# EAGLE design SAM E70-XplainedShield - DualStepperMotorDriver (EAGLE 9.1.3)
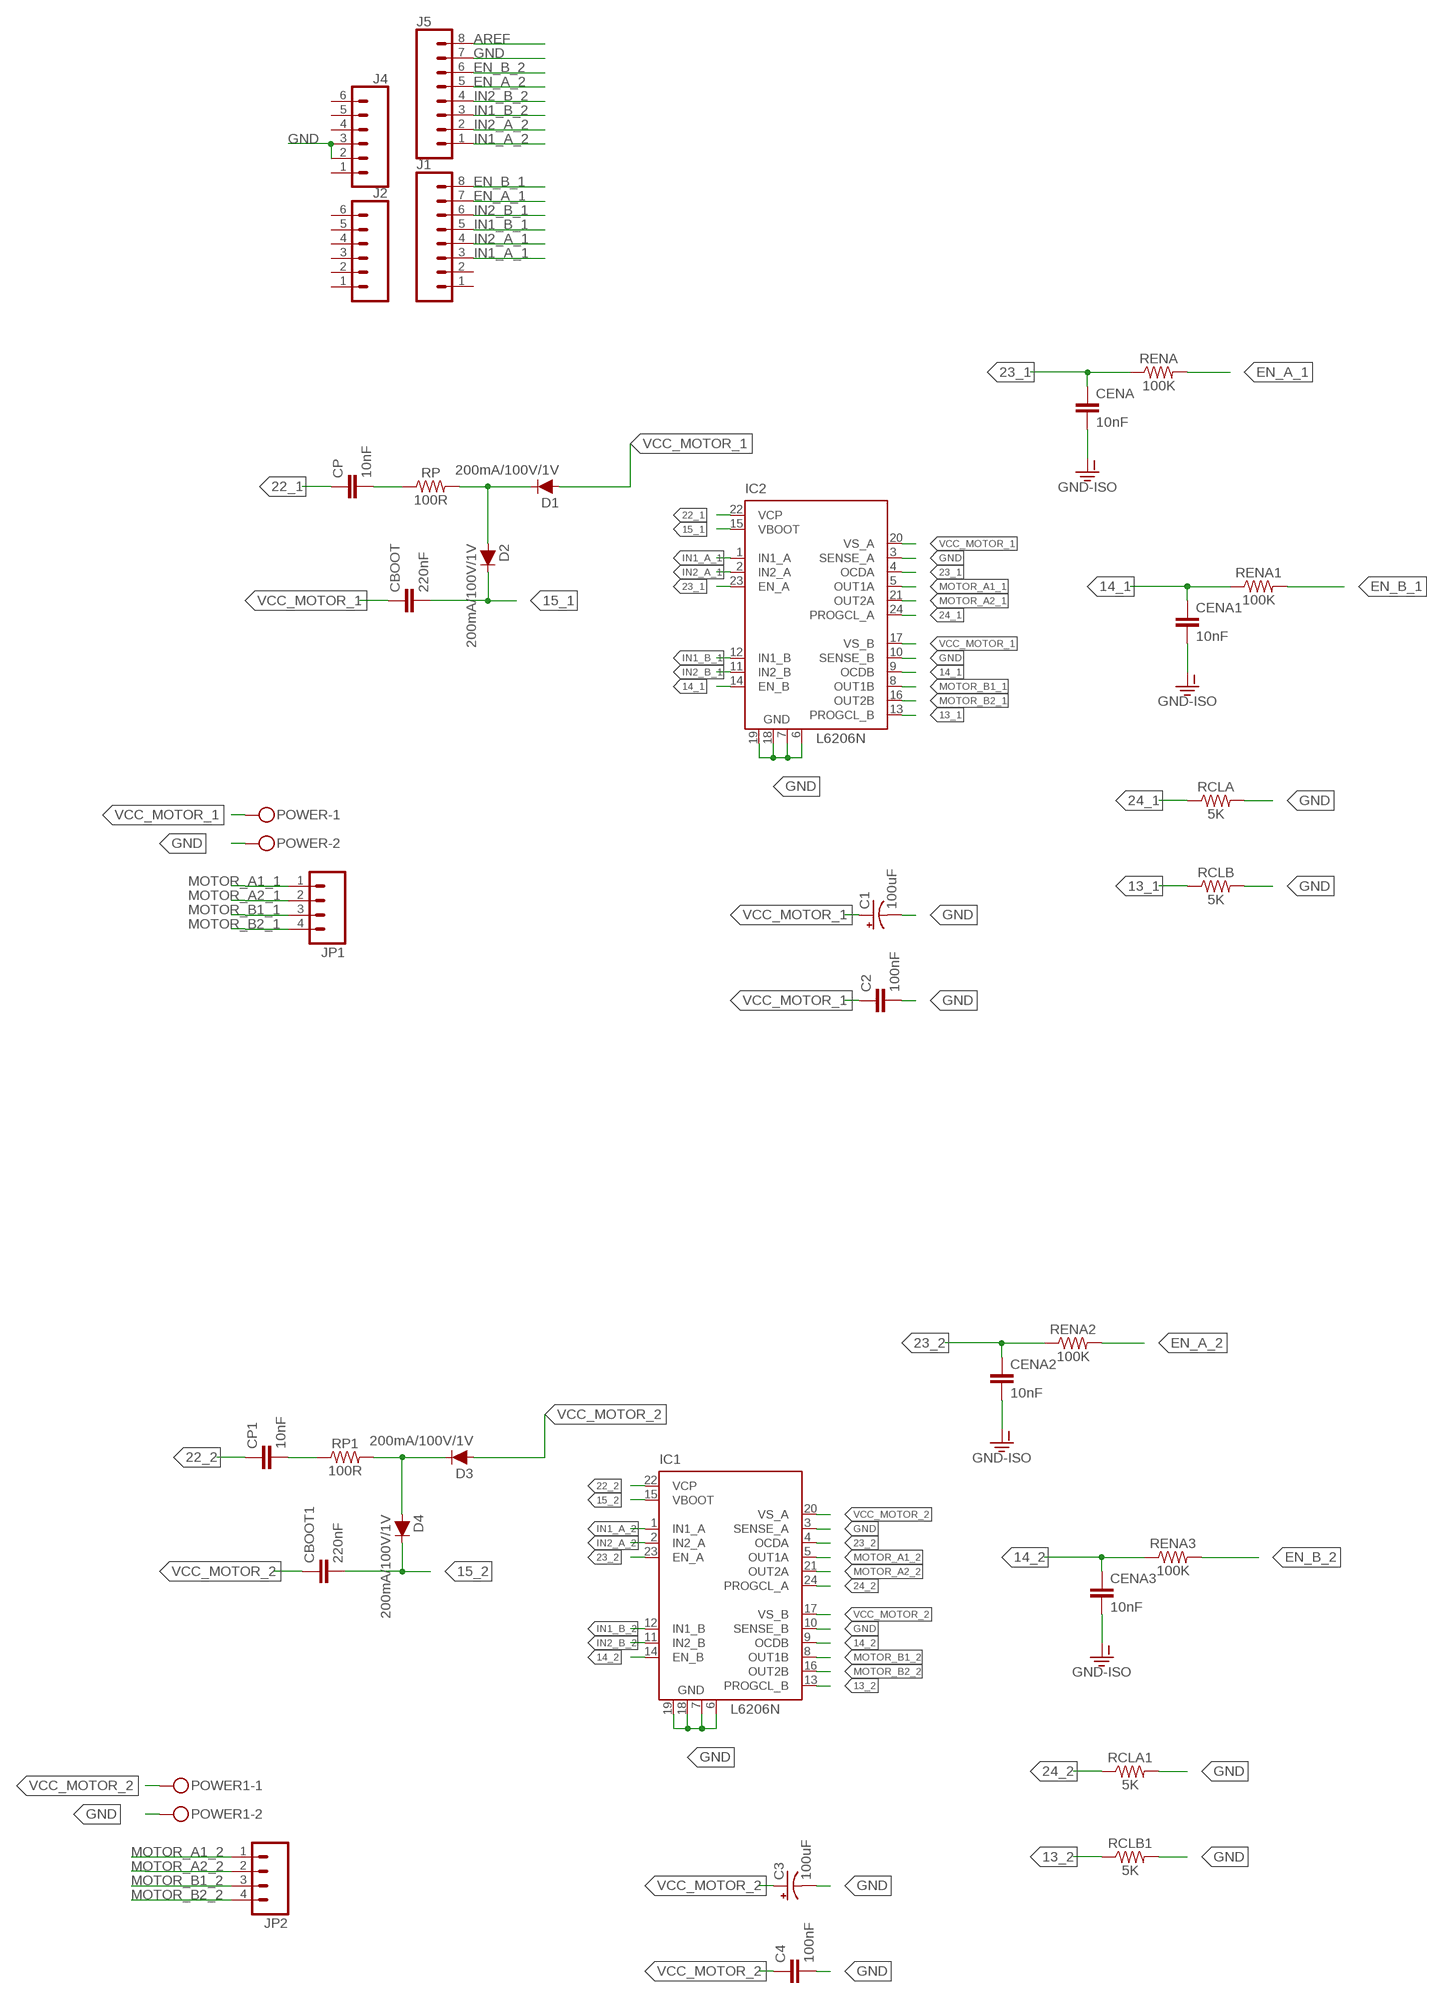
[diagram p0: schematic, sheet 1]

## Parts
C1  100uF  CAP_POLPTH1  [CPOL-RADIAL-100UF-25V]
C2  100nF  CAPKIT  [CAP-PTH-SMALL-KIT]
C3  100uF  CAP_POLPTH1  [CPOL-RADIAL-100UF-25V]
C4  100nF  CAPKIT  [CAP-PTH-SMALL-KIT]
CBOOT  220nF  CAPKIT  [CAP-PTH-SMALL-KIT]
CBOOT1  220nF  CAPKIT  [CAP-PTH-SMALL-KIT]
CENA  10nF  CAPKIT  [CAP-PTH-SMALL-KIT]
CENA1  10nF  CAPKIT  [CAP-PTH-SMALL-KIT]
CENA2  10nF  CAPKIT  [CAP-PTH-SMALL-KIT]
CENA3  10nF  CAPKIT  [CAP-PTH-SMALL-KIT]
CP  10nF  CAPKIT  [CAP-PTH-SMALL-KIT]
CP1  10nF  CAPKIT  [CAP-PTH-SMALL-KIT]
D1  200mA/100V/1V  DIODE-1N4148  [DIODE-1N4148]
D2  200mA/100V/1V  DIODE-1N4148  [DIODE-1N4148]
D3  200mA/100V/1V  DIODE-1N4148  [DIODE-1N4148]
D4  200mA/100V/1V  DIODE-1N4148  [DIODE-1N4148]
IC1  L6206N  [DIL24S]
IC2  L6206N  [DIL24S]
J1  CONN_08LONGPADS  [1X08_LONGPADS]
J2  CONN_06LONGPADS  [1X06_LONGPADS]
J4  CONN_06LONGPADS  [1X06_LONGPADS]
J5  CONN_08LONGPADS  [1X08_LONGPADS]
JP1  M04LONGPADS  [1X04_LONGPADS]
JP2  M04LONGPADS  [1X04_LONGPADS]
POWER  MKDSN1,5/2-5,08  [MKDSN1,5/2-5,08]
POWER1  MKDSN1,5/2-5,08  [MKDSN1,5/2-5,08]
RCLA  5K  RESISTORAXIAL-0.3-KIT  [AXIAL-0.3-KIT]
RCLA1  5K  RESISTORAXIAL-0.3-KIT  [AXIAL-0.3-KIT]
RCLB  5K  RESISTORAXIAL-0.3-KIT  [AXIAL-0.3-KIT]
RCLB1  5K  RESISTORAXIAL-0.3-KIT  [AXIAL-0.3-KIT]
RENA  100K  RESISTORAXIAL-0.3-KIT  [AXIAL-0.3-KIT]
RENA1  100K  RESISTORAXIAL-0.3-KIT  [AXIAL-0.3-KIT]
RENA2  100K  RESISTORAXIAL-0.3-KIT  [AXIAL-0.3-KIT]
RENA3  100K  RESISTORAXIAL-0.3-KIT  [AXIAL-0.3-KIT]
RP  100R  RESISTORAXIAL-0.3-KIT  [AXIAL-0.3-KIT]
RP1  100R  RESISTORAXIAL-0.3-KIT  [AXIAL-0.3-KIT]

## Nets
13_1: IC2.13(PROGCL_B) RCLB.P$1
13_2: IC1.13(PROGCL_B) RCLB1.P$1
14_1: CENA1.1 IC2.9(OCDB) IC2.14(EN_B) RENA1.P$1
14_2: CENA3.1 IC1.9(OCDB) IC1.14(EN_B) RENA3.P$1
15_1: CBOOT.2 D2.C IC2.15(VBOOT)
15_2: CBOOT1.2 D4.C IC1.15(VBOOT)
22_1: CP.1 IC2.22(VCP)
22_2: CP1.1 IC1.22(VCP)
23_1: CENA.1 IC2.4(OCDA) IC2.23(EN_A) RENA.P$1
23_2: CENA2.1 IC1.4(OCDA) IC1.23(EN_A) RENA2.P$1
24_1: IC2.24(PROGCL_A) RCLA.P$1
24_2: IC1.24(PROGCL_A) RCLA1.P$1
AREF: J5.8
EN_A_1: J1.7 RENA.P$2
EN_A_2: J5.5 RENA2.P$2
EN_B_1: J1.8 RENA1.P$2
EN_B_2: J5.6 RENA3.P$2
GND: C1.2(-) C2.2 C3.2(-) C4.2 CENA1.2 CENA2.2 CENA3.2 CENA.2 IC1.3(SENSE_A) IC1.6(GND) IC1.7(GND) IC1.10(SENSE_B) IC1.18(GND) IC1.19(GND) IC2.3(SENSE_A) IC2.6(GND) IC2.7(GND) IC2.10(SENSE_B) IC2.18(GND) IC2.19(GND) J4.2 J4.3 J5.7 POWER1.2 POWER.2 RCLA1.P$2 RCLA.P$2 RCLB1.P$2 RCLB.P$2 ; supply symbol labelled GND-ISO
IN1_A_1: IC2.1(IN1_A) J1.3
IN1_A_2: IC1.1(IN1_A) J5.1
IN1_B_1: IC2.12(IN1_B) J1.5
IN1_B_2: IC1.12(IN1_B) J5.3
IN2_A_1: IC2.2(IN2_A) J1.4
IN2_A_2: IC1.2(IN2_A) J5.2
IN2_B_1: IC2.11(IN2_B) J1.6
IN2_B_2: IC1.11(IN2_B) J5.4
MOTOR_A1_1: IC2.5(OUT1A) JP1.1
MOTOR_A1_2: IC1.5(OUT1A) JP2.1
MOTOR_A2_1: IC2.21(OUT2A) JP1.2
MOTOR_A2_2: IC1.21(OUT2A) JP2.2
MOTOR_B1_1: IC2.8(OUT1B) JP1.3
MOTOR_B1_2: IC1.8(OUT1B) JP2.3
MOTOR_B2_1: IC2.16(OUT2B) JP1.4
MOTOR_B2_2: IC1.16(OUT2B) JP2.4
N$1: CP1.2 RP1.P$1
N$2: CP.2 RP.P$1
N$3: D1.C D2.A RP.P$2
N$4: D3.C D4.A RP1.P$2
VCC_MOTOR_1: C1.1(+) C2.1 CBOOT.1 D1.A IC2.17(VS_B) IC2.20(VS_A) POWER.1
VCC_MOTOR_2: C3.1(+) C4.1 CBOOT1.1 D3.A IC1.17(VS_B) IC1.20(VS_A) POWER1.1
Unconnected: J1.1 J1.2 J2.1 J2.2 J2.3 J2.4 J2.5 J2.6 J4.1 J4.4 J4.5 J4.6

## Library data of the parts
C1 C3 = SparkFun-Capacitors:CAP_POL: Capacitor Polarized These are standard SMD and PTH capacitors. Normally 10uF, 47uF, and 100uF in electrolytic and tantalum varieties. Always verify the external diameter of the through hole cap, it varies with capacity, voltage, and manufacturer. The EIA devices should be standard.
C2 C4 CBOOT CBOOT1 CENA CENA1-CENA3 CP CP1 = SparkFun-Capacitors:CAP: Capacitor Standard 0603 ceramic capacitor, and 0.1" leaded capacitor.
D1-D4 = SparkFun-DiscreteSemi:DIODE: Diode These are standard reverse protection diodes and small signal diodes. SparkFun Products: SparkFun SparkPunk Sound Kit <https://www.sparkfun.com/products/11177> SparkFun ESP8266 Thing <https://www.sparkfun.com/products/13231>; PROD_ID: DIO-08378
IC1 IC2 = L6206:L6206: DMOS dual full bridge driver
J1 J5 = SparkFun-Connectors:CONN_08: Multi connection point. Often used as Generic Header-pin footprint for 0.1 inch spaced/style header connections On any of the 0.1 inch spaced packages, you can populate with these: Break Away Headers - Straight <https://www.sparkfun.com/products/116> (PRT-00116) Break Away Male Headers - Right Angle <https://www.sparkfun.com/products/553> (PRT-00553) Female Headers <https://www.sparkfun.com/products/115> (PRT-00115) Break Away Headers - Machine Pin <https://www.sparkfun.com/products/117> (PRT-00117) Break Away Female Headers - Swiss Machine Pin <https://www.sparkfun.com/products/743> (PRT-00743) Arduino Stackable Header - 8 Pin <https://www.sparkfun.com/products/9279> (PRT-09279) For SCREWTERMINALS and SPRING TERMINALS visit here: Screw Terimnals on SparkFun.com <https://www.sparkfun.com/search/results?term=Screw+Terminals> (5mm/3.5mm/2.54mm spacing) This device is also useful as a general connection point to wire up your design to another part of your project. Our various solder wires solder well into these plated through hole pads. Hook-Up Wire - Assortment (Stranded, 22 AWG) <https://www.sparkfun.com/products/11375> (PRT-11375) Hook-Up Wire - Assortment (Solid Core, 22 AWG) <https://www.sparkfun.com/products/11367> (PRT-11367) View the entire wire category on our website here <https://www.sparkfun.com/categories/141> Special notes: Molex polarized connector foot print use with SKU : PRT-08231 with associated crimp pins and housings. 1MM SMD Version SKU: PRT-10208 NOTES ON THE VARIANTS LOCK and LOCK_LONGPADS... This footprint was designed to help hold the alignment of a through-hole component (i.e. 6-pin header) while soldering it into place. You may notice that each hole has been shifted either up or down by 0.005 of an inch from it's more standard position (which is a perfectly straight line). This slight alteration caused the pins (the squares in the middle) to touch the edges of the holes. Because they are alternating, it causes a "brace" to hold the component in place. 0.005 has proven to be the perfect amount of "off-center" position when using our standard breakaway headers. Although looks a little odd when you look at the bare footprint, once you have a header in there, the alteration is very hard to notice. Also,if you push a header all the way into place, it is covered up entirely on the bottom side.
J2 J4 = SparkFun-Connectors:CONN_06: Multi connection point. Often used as Generic Header-pin footprint for 0.1 inch spaced/style header connections On any of the 0.1 inch spaced packages, you can populate with these: Break Away Headers - Straight <https://www.sparkfun.com/products/116> (PRT-00116) Break Away Male Headers - Right Angle <https://www.sparkfun.com/products/553> (PRT-00553) Female Headers <https://www.sparkfun.com/products/115> (PRT-00115) Break Away Headers - Machine Pin <https://www.sparkfun.com/products/117> (PRT-00117) Break Away Female Headers - Swiss Machine Pin <https://www.sparkfun.com/products/743> (PRT-00743) Arduino Stackable Header - 6 Pin <https://www.sparkfun.com/products/9280> (PRT-09280) For SCREWTERMINALS and SPRING TERMINALS visit here: Screw Terimnals on SparkFun.com <https://www.sparkfun.com/search/results?term=Screw+Terminals> (5mm/3.5mm/2.54mm spacing) This device is also useful as a general connection point to wire up your design to another part of your project. Our various solder wires solder well into these plated through hole pads. Hook-Up Wire - Assortment (Stranded, 22 AWG) <https://www.sparkfun.com/products/11375> (PRT-11375) Hook-Up Wire - Assortment (Solid Core, 22 AWG) <https://www.sparkfun.com/products/11367> (PRT-11367) View the entire wire category on our website here <https://www.sparkfun.com/categories/141>
JP1 JP2 = SparkFun-Connectors:M04: Header 4 Standard 4-pin 0.1" header. Use with straight break away headers (SKU : PRT-00116), right angle break away headers (PRT-00553), swiss pins (PRT-00743), machine pins (PRT-00117), and female headers (PRT-00115). Molex polarized connector foot print use with SKU : PRT-08231 with associated crimp pins and housings. 1MM SMD Version SKU: PRT-10208
POWER POWER1 = con-phoenix-508:MKDSN1,5/2-5,08: MKDSN 1,5/ 2-5,08 Printklemme Nennstrom: 13,5 A Nennspannung: 250 V Rastermaß: 5,08 mm Polzahl: 2 Anschlussart: Schraubanschluss Montage: Löten Anschlussrichtung Leiter/Platine: 0 ° Artikelnummer: 1729128 Source: http://eshop.phoenixcontact.com .. 1729128.pdf
RCLA RCLA1 RCLB RCLB1 RENA RENA1-RENA3 RP RP1 = SparkFun-Resistors:RESISTOR: Generic Resistor Package

## Net classes
0 default: width 0.7 mm, drill 0.9 mm, clearance 0.205 mm

## Board
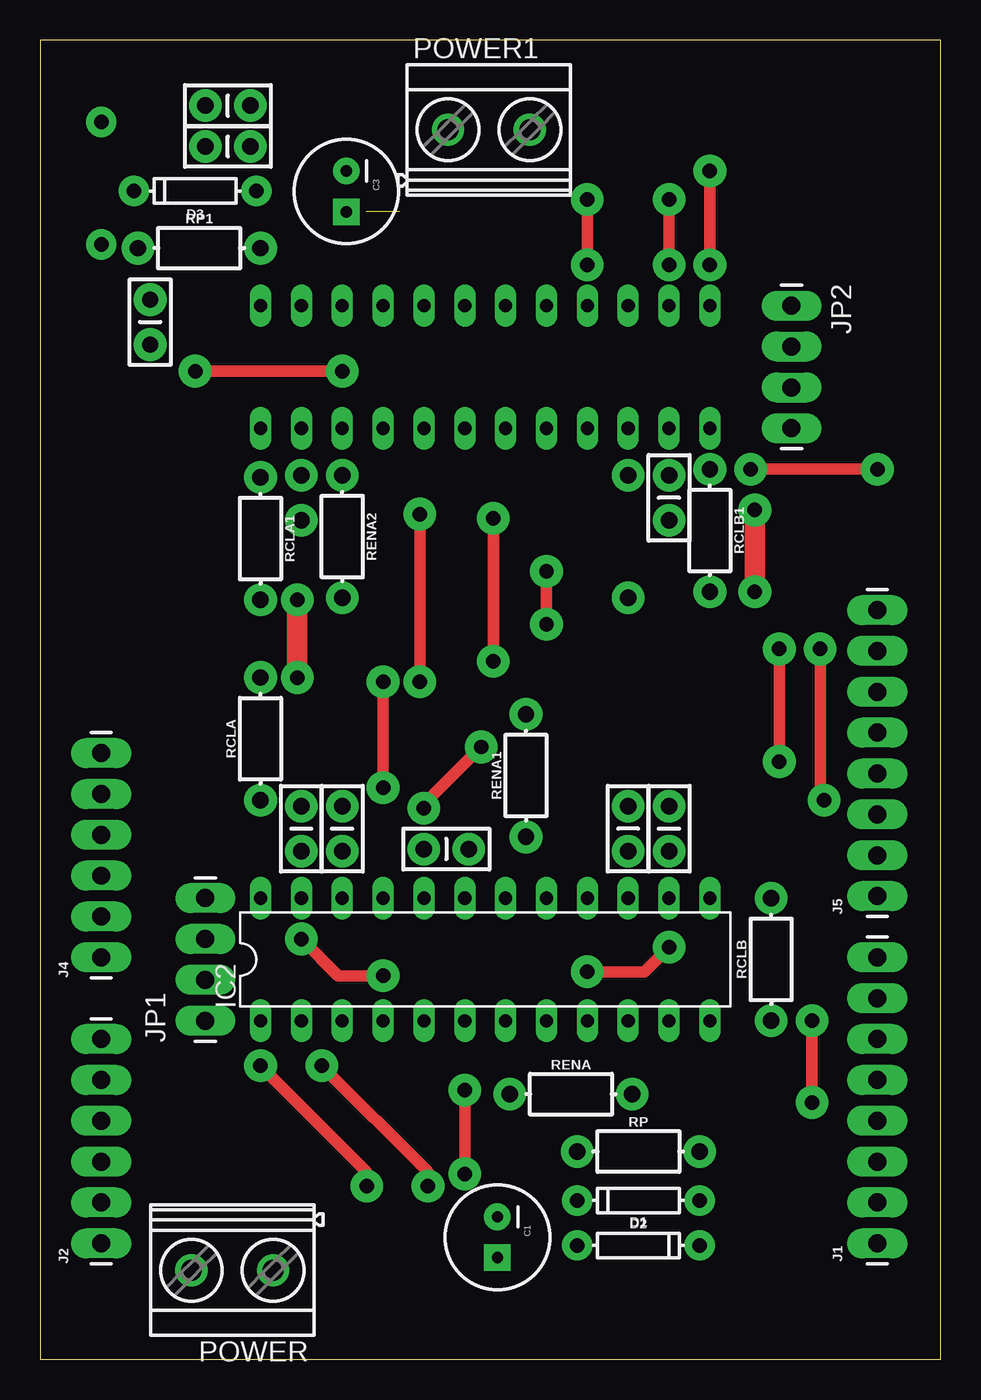
[diagram p1: board, top side]
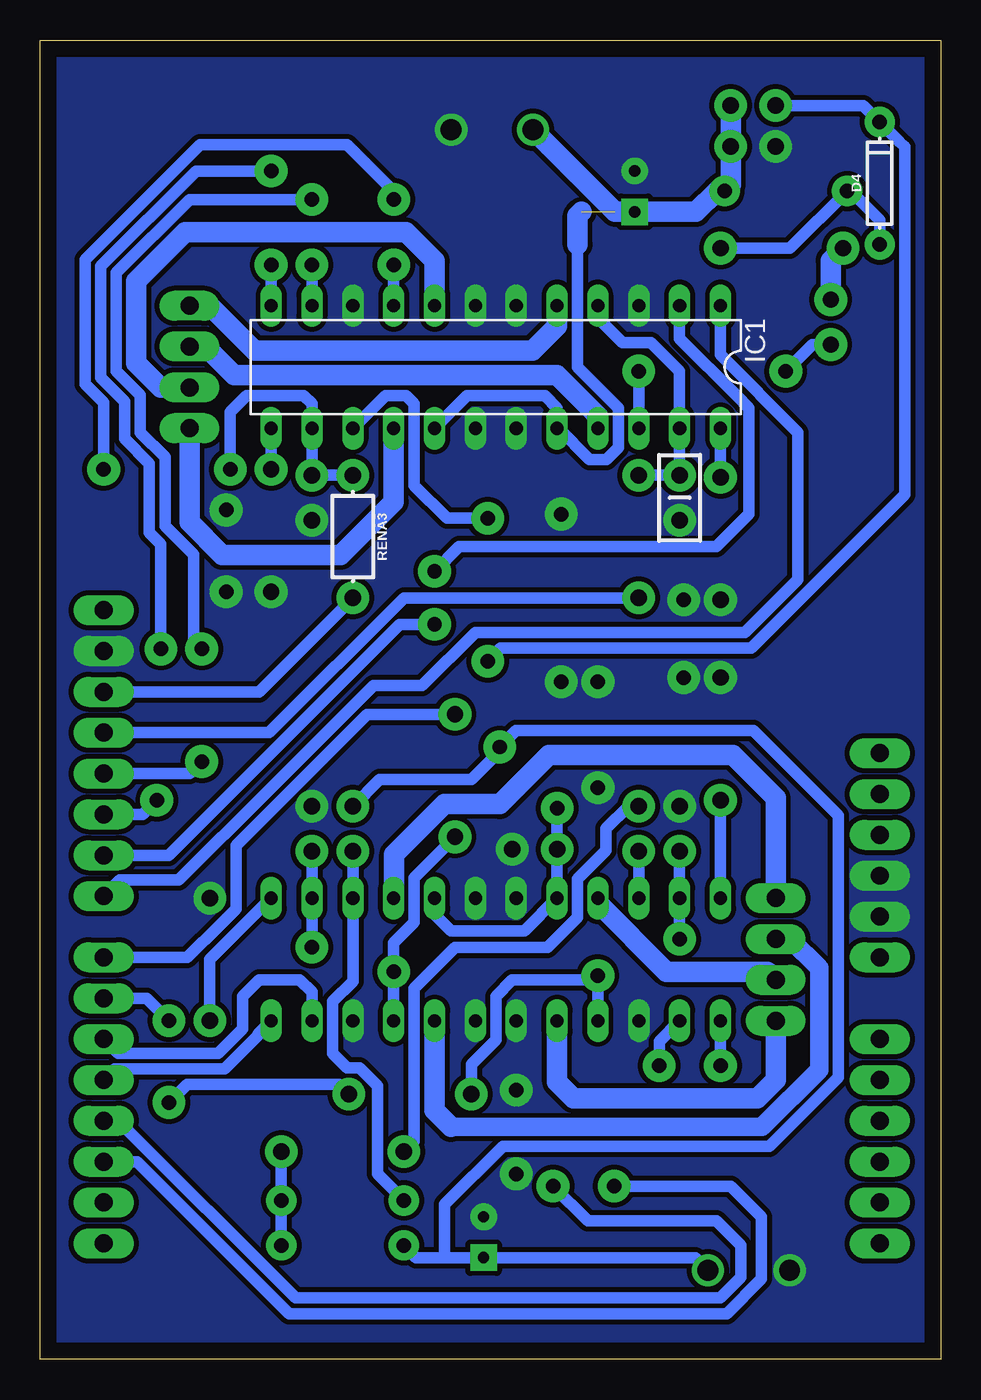
[diagram p2: board, bottom side, seen from below]

Size 56 x 82.01 mm. Coordinates in mm from the lower left corner, seen from the top.
Outline: 0,0 56,0 56,82.01 0,82.01 0,0
Copper layers (1*16): Top 0.035mm / dielectric 1.5mm / Bottom 0.035mm
Design rules "default *": minimum track width 24mil, minimum drill 0.35mm, track to track 10mil, track to pad 10mil, pad to pad 10mil, via to via 10mil, smd to smd 6mil, copper to edge 40mil, drill to drill 6mil, minimum pad ring 10mil, minimum via ring 8mil, stop-mask expansion 4mil, vias tented up to drill 0mil, thermal gap 10mil

### Footprints (pad centres in the part's own frame; a part is rotated, then mirrored left to right if it is on the bottom)
CPOL-RADIAL-100UF-25V = drill 0.7 pad 1.651 square: 1 1.27,0 | drill 0.7 pad 1.651: 2 -1.27,0
CAP-PTH-SMALL-KIT = drill 1.016 pad 2.032: 1 -1.397,0; 2 1.397,0
DIODE-1N4148 = drill 0.9 pad 1.88: A -3.81,0; C 3.81,0
DIL24S = drill 0.813 long: 1 -13.97,-3.81; 2 -11.43,-3.81; 3 -8.89,-3.81; 4 -6.35,-3.81; 5 -3.81,-3.81; 6 -1.27,-3.81; 7 1.27,-3.81; 8 3.81,-3.81; 9 6.35,-3.81; 10 8.89,-3.81; 11 11.43,-3.81; 12 13.97,-3.81; 13 13.97,3.81; 14 11.43,3.81; 15 8.89,3.81; 16 6.35,3.81; 17 3.81,3.81; 18 1.27,3.81; 19 -1.27,3.81; 20 -3.81,3.81; 21 -6.35,3.81; 22 -8.89,3.81; 23 -11.43,3.81; 24 -13.97,3.81
1X08_LONGPADS = drill 1.118 pad 1.88 long: 1 0,0; 2 2.54,0; 3 5.08,0; 4 7.62,0; 5 10.16,0; 6 12.7,0; 7 15.24,0; 8 17.78,0
1X06_LONGPADS = drill 1.118 pad 1.88 long: 1 0,0; 2 2.54,0; 3 5.08,0; 4 7.62,0; 5 10.16,0; 6 12.7,0
1X04_LONGPADS = drill 1.118 pad 1.88 long: 1 0,0; 2 2.54,0; 3 5.08,0; 4 7.62,0
MKDSN1,5/2-5,08 = drill 1.3 pad 2: 1 -2.561,0.025; 2 2.519,0.025
AXIAL-0.3-KIT = drill 1.016 pad 2.032: P$1 -3.81,0; P$2 3.81,0

### Placement (x,y rotation side)
C1  28.43,7.59 270 top
C2  25.26,31.72 0 top
C3  19.03,72.61 270 top
C4  11.67,75.41 180 top
CBOOT  36.56,32.99 270 top
CBOOT1  11.67,77.95 180 top
CENA  16.24,32.99 90 top
CENA1  39.1,32.99 90 top
CENA2  16.24,53.56 270 bottom
CENA3  39.1,53.56 270 top
CP  18.78,32.99 90 top
CP1  6.84,64.48 90 top
D1  37.2,7.08 0 top
D2  37.2,9.87 180 top
D3  9.64,72.64 180 top
D4  3.79,73.12 90 bottom
IC1  27.67,61.69 180 bottom
IC2  27.67,24.86 0 top
J1  52.05,7.21 90 top
J2  3.79,7.21 90 top
J4  3.79,24.99 90 top
J5  52.05,28.8 90 top
JP1  10.27,21.05 90 top
JP2  46.72,65.5 270 top
POWER  11.92,5.56 180 top
POWER1  27.92,76.42 0 top
RCLA  13.7,38.58 90 top
RCLA1  13.7,51.02 270 top
RCLB  45.45,24.86 90 top
RCLB1  41.64,51.53 270 top
RENA  33,16.48 0 top
RENA1  30.21,36.29 90 top
RENA2  18.78,51.15 270 top
RENA3  36.56,51.15 270 bottom
RP  37.2,12.92 0 top
RP1  9.89,69.08 0 top

### Tracks (layer width: path | path; a pad name or v marks a point on that pad's centre or on a via)
13_1
  Bottom 0.7: IC2.13 45.45,24.86
  Bottom 0.711: 45.45,24.86 RCLB.P$1
13_2
  Bottom 0.711: RCLB1.P$1 IC1.13
14_1  (via drill 0.9 pad 2.03)
  Top 0.711: v34.02,24.1 37.58,24.1 v39.1,25.62
  Bottom 0.711: v39.1,25.62 IC2.14 CENA1.1 | RENA1.P$1 32.75,29.94 32.75,27.15 34.02,25.88 v34.02,24.1 IC2.9
14_2  (via drill 0.9 pad 2.03)
  Top 0.711: v44.18,55.34 v52.05,55.34 | v34.02,72.1 v34.02,68.04
  Bottom 0.7: RENA3.P$1 CENA3.1 IC1.14
  Bottom 0.711: IC1.14 39.1,59.4 39.61,59.91 43.16,59.91 44.18,58.9 v44.18,55.34 | v52.05,55.34 52.05,59.49 53.2,60.63 53.2,68.36 46.05,75.51 36.92,75.51 34.02,72.61 v34.02,72.1 | v34.02,68.04 IC1.9
15_1
  Bottom 0.711: D2.C 34.59,11.08 35.04,11.53 35.04,17 36.14,18.1 36.92,18.1 37.83,19.02 37.83,22.24 36.56,23.51 IC2.15 CBOOT.2
15_2  (via drill 0.9 pad 2.03)
  Top 0.711: v28.18,52.29 v28.18,43.4
  Bottom 0.711: CBOOT1.2 4.81,77.95 D4.C 2.55,75.68 | IC1.15 34.53,59.91 34.02,59.91 33.26,59.91 32.75,59.4 32.75,54.32 30.72,52.29 v28.18,52.29 | v28.18,43.4 27.36,44.22 11.78,44.22 2.25,53.75 2.25,75.38 2.55,75.68 | 2.27,75.41 2.55,75.68
22_1
  Bottom 0.711: IC2.22 CP.1
22_2  (via drill 0.9 pad 2.03)
  Top 0.711: v18.78,61.44 v9.64,61.44
  Bottom 0.711: IC1.22 v18.78,61.44 | v9.64,61.44 7.99,63.09 CP1.1
23_1  (via drill 0.9 pad 2.03)
  Top 0.711: v16.24,26.13 18.53,23.84 v21.32,23.84
  Bottom 0.711: RENA.P$1 29.19,18.34 27.67,19.86 27.67,22.57 26.65,23.59 21.57,23.59 v21.32,23.84 IC2.4 | CENA.1 IC2.23 v16.24,26.13
23_2
  Bottom 0.711: RENA2.P$1 CENA2.1 IC1.23 16.24,61.44 18.02,63.21 19.8,63.21 21.32,64.74 IC1.4
24_1
  Bottom 0.711: IC2.24 RCLA.P$1
24_2
  Bottom 0.711: RCLA1.P$1 IC1.24
EN_A_1  (via drill 0.9 pad 2.03)
  Top 0.711: v47.99,15.97 v47.99,21.05
  Bottom 0.711: J1.7 49.39,22.45 v47.99,21.05 | v47.99,15.97 46.87,17.09 37.42,17.09 RENA.P$2
EN_A_2
  Bottom 0.711: RENA2.P$2 33.38,47.34 41.77,38.96 J5.5
EN_B_1
  Bottom 0.711: RENA1.P$2 35.68,40.1 43.82,31.96 43.82,28 44.78,27.04 44.79,27.04 46.85,24.99 J1.8
EN_B_2
  Bottom 0.711: J5.6 42.4,41.5 RENA3.P$2
GND  (via drill 0.9 pad 2.03)
  Top 0.711: v23.61,52.55 v23.61,42.13 | v21.32,42.13 v21.32,35.53 | v26.4,16.73 v26.4,11.53
  Top 1.27: v44.43,52.8 v44.43,47.72 | v15.99,42.39 v15.99,47.21
  pour Bottom (isolate 0.305, no thermals): 0,0 56,0 56,82 0,82
IN1_A_1  (via drill 0.9 pad 2.03)
  Top 0.711: v13.7,18.26 20.3,11.65 v20.3,10.76
  Bottom 0.711: v13.7,18.26 IC2.1 | v20.3,10.76 13.06,10.76 11.16,8.86 11.16,5 13.32,2.85 40.53,2.85 49.97,12.29 J1.3
IN1_A_2
  Bottom 0.711: J5.1 51.06,29.79 47.38,29.79 41.89,35.27 41.88,35.27 35.27,41.88 32.24,41.88 28.94,45.18 12.18,45.18 10.4,46.96 8.87,48.48 8.87,57.63 13.7,62.45 IC1.1
IN1_B_1
  Bottom 0.711: IC2.12 42.45,20.24 42.45,20.14 43.12,19.48 44.54,18.05 51.37,18.05 J1.5
IN1_B_2  (via drill 0.9 pad 2.03)
  Top 0.711: v41.64,73.88 v41.64,68.04 | v48.5,44.16 48.5,35.02 v48.75,34.77
  Bottom 0.711: v41.64,73.88 44.18,73.88 46.31,73.88 52.23,67.96 52.23,61.03 50.73,59.53 50.73,57.23 49.21,55.7 49.21,51.4 48.5,50.69 48.5,47.72 v48.5,44.16 | v41.64,68.04 IC1.12 | J5.3 49.64,33.88 v48.75,34.77
IN2_A_1  (via drill 0.9 pad 2.03)
  Top 0.711: v17.51,18.26 24.11,11.65 v24.11,10.76
  Bottom 0.711: v17.51,18.26 17.51,19.78 IC2.2 | v24.11,10.76 21.95,8.6 13.95,8.6 12.43,7.08 12.43,5.1 13.72,3.81 40.13,3.81 51.15,14.83 J1.4
IN2_A_2  (via drill 0.9 pad 2.03)
  Top 0.711: v31.48,48.99 v31.48,45.69
  Bottom 0.711: v31.48,48.99 29.96,50.51 13.95,50.51 11.92,52.55 11.92,58.64 11.92,59.15 12.68,59.91 16.24,63.47 IC1.2 | v31.48,45.69 33.67,45.69 48.02,31.34 J5.2
IN2_B_1
  Bottom 0.711: J1.6 51.16,19.02 44.94,19.02 43.42,20.54 43.42,22.57 42.4,23.59 39.86,23.59 39.1,22.83 IC2.11
IN2_B_2  (via drill 0.9 pad 2.03)
  Top 0.711: v39.1,72.1 v39.1,68.04 | v45.96,37.16 v45.96,44.16
  Bottom 0.711: v39.1,72.1 42.66,72.1 46.72,72.1 51.27,67.56 51.27,61.43 49.77,59.93 49.77,57.63 48.24,56.1 48.24,51.8 46.47,50.02 46.47,44.67 v45.96,44.16 | v39.1,68.04 IC1.11 | J5.4 46.7,36.42 v45.96,37.16
MOTOR_A1_1
  Bottom 1.27: IC2.5 23.86,17.24 22.84,16.22 11.41,16.22 10.27,17.37 JP1.1
MOTOR_A1_2
  Bottom 1.27: JP2.1 45.45,65.5 42.66,62.71 25.38,62.71 23.86,64.23 IC1.5
MOTOR_A2_1
  Bottom 1.27: JP1.2 10.78,24.1 17.06,24.1 21.32,28.36 IC2.21
MOTOR_A2_2
  Bottom 1.27: IC1.21 21.32,58.64 23.86,61.18 43.93,61.18 45.7,62.96 JP2.2
MOTOR_B1_1
  Bottom 1.143: 30.46,14.45 11.13,14.45 7.57,18.01 7.57,24.32 9.38,26.13 JP1.3
  Bottom 1.27: IC2.8 31.48,15.46 30.46,14.45
MOTOR_B1_2
  Bottom 1.27: JP2.3 48.5,60.42 50.02,61.94 50.02,67.02 46.97,70.07 33.26,70.07 31.48,68.29 IC1.8
MOTOR_B2_1
  Bottom 1.27: IC2.16 33.99,28.7 33.99,31.39 30.87,34.51 27.42,34.51 24.37,37.56 12.94,37.56 10.27,34.89 JP1.4
MOTOR_B2_2
  Bottom 1.27: IC1.16 34.02,53.31 37.32,50.01 44.69,50.01 46.72,52.04 JP2.4
N$1
  Bottom 1.27: RP1.P$1 6.84,68.32 CP1.2
N$2
  Bottom 0.711: CP.2 19.41,34.38 20.81,32.99 20.81,31.63 22.59,29.86 22.59,27.48 24.45,25.62 30.21,25.62 32.39,23.44 32.39,23.43 32.75,23.07 32.75,13.56 RP.P$1
N$3
  Bottom 0.711: D1.C D2.A RP.P$2
N$4
  Bottom 0.711: RP1.P$2 11.16,69.08 10.14,69.08 9.38,69.08 D3.C 5.6,72.64 3.79,70.83 D4.A
VCC_MOTOR_1  (via drill 0.9 pad 2.03)
  Top 0.711: v23.86,34.26 23.86,34.51 v27.42,38.07
  Bottom 0.711: POWER.1 15.27,6.32 C1.1 30.84,6.32 | 30.84,6.32 32.62,6.32 D1.A | IC2.17 31.48,27.65 30.46,26.64 25.89,26.64 IC2.20 C2.1 v23.86,34.26 | CBOOT.1 34.91,36.04 29.19,36.04 27.42,37.81 v27.42,38.07 26.4,39.08 11.67,39.08 6.38,33.8 6.38,17.52 10.66,13.25 27.22,13.25 30.84,9.62 30.84,6.32
VCC_MOTOR_2  (1 unrouted)
  Bottom 0.711: IC1.17 29.45,59.91 24.62,59.91 23.86,59.15 IC1.20 23.78,57.88 21.85,55.95 20.79,55.95 20.05,56.69 20.05,59.13 22.59,61.67 22.59,69.31
  Bottom 1.27: CBOOT1.1 C4.1 13.06,73.02 D3.A 13.93,72.64 15.22,71.34 C3.1 20.26,71.34 POWER1.1 | 22.59,69.31 22.59,71.09 22.34,71.34